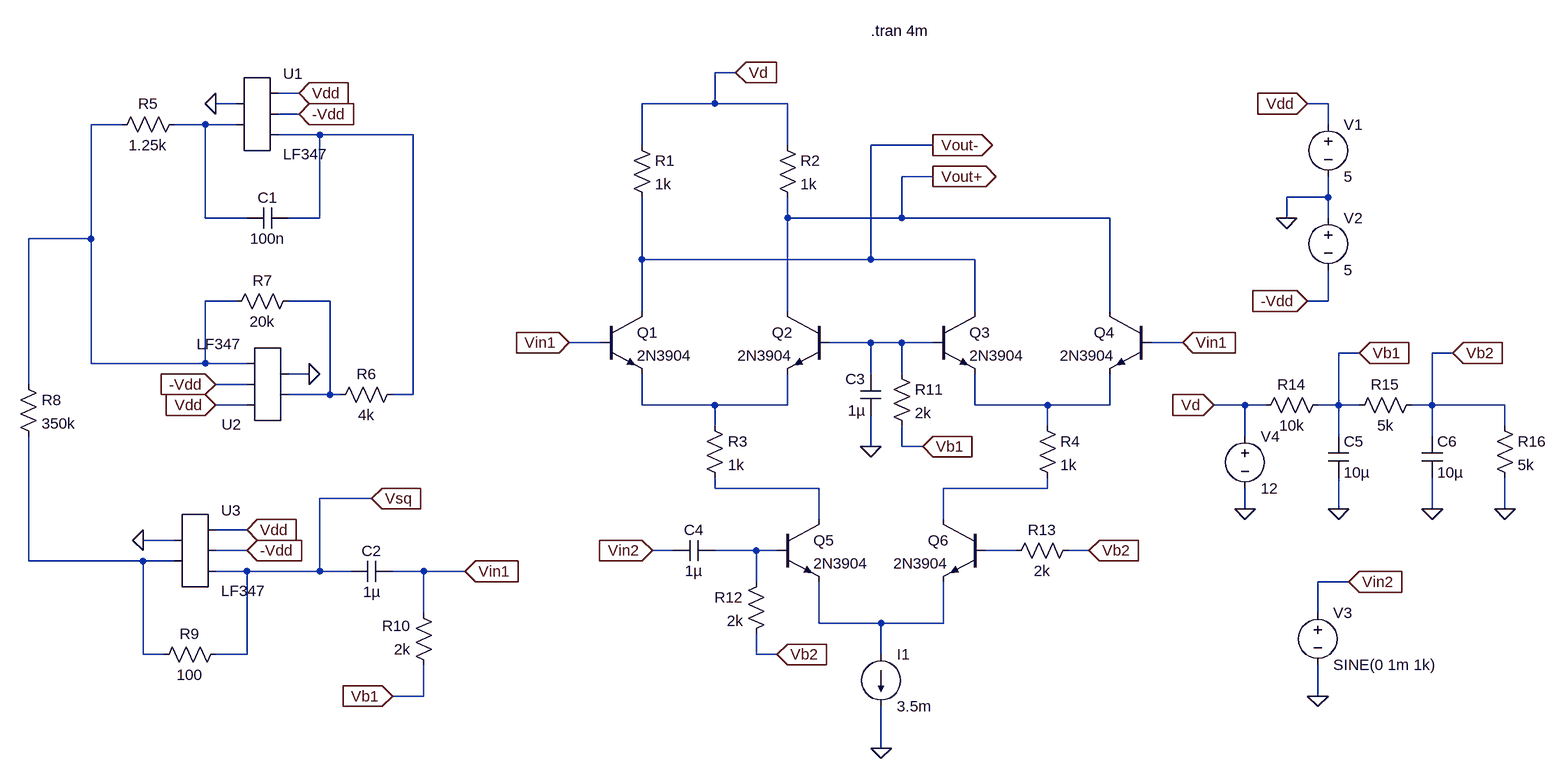
[diagram p0: schematic 3_Implementation.asc]
3_Implementation.asc, the LTspice schematic file:
Version 4
SHEET 1 1780 1148
WIRE 512 -48 480 -48
WIRE -160 -16 -192 -16
WIRE -256 0 -288 0
WIRE 480 0 480 -48
WIRE 480 0 368 0
WIRE 592 0 480 0
WIRE 1424 0 1392 0
WIRE -160 16 -192 16
WIRE -432 32 -480 32
WIRE -304 32 -352 32
WIRE -256 32 -304 32
WIRE 1424 32 1424 0
WIRE -128 48 -192 48
WIRE 16 48 -128 48
WIRE 368 64 368 0
WIRE 592 64 592 0
WIRE 816 64 720 64
WIRE 816 112 768 112
WIRE 1424 144 1424 112
WIRE 1424 144 1360 144
WIRE -304 176 -304 32
WIRE -240 176 -304 176
WIRE -128 176 -128 48
WIRE -128 176 -176 176
WIRE 592 176 592 144
WIRE 768 176 768 112
WIRE 768 176 592 176
WIRE 1088 176 768 176
WIRE 1360 176 1360 144
WIRE 1424 176 1424 144
WIRE -480 208 -480 32
WIRE -480 208 -576 208
WIRE 368 240 368 144
WIRE 720 240 720 64
WIRE 720 240 368 240
WIRE 880 240 720 240
WIRE -256 304 -304 304
WIRE -112 304 -176 304
WIRE 1424 304 1424 256
WIRE 1424 304 1392 304
WIRE 368 320 368 240
WIRE 592 320 592 176
WIRE 880 320 880 240
WIRE 1088 320 1088 176
WIRE 304 368 256 368
WIRE 720 368 656 368
WIRE 768 368 720 368
WIRE 816 368 768 368
WIRE 1200 368 1152 368
WIRE 1472 384 1440 384
WIRE 1616 384 1584 384
WIRE -480 400 -480 208
WIRE -304 400 -304 304
WIRE -304 400 -480 400
WIRE -240 400 -304 400
WIRE -144 416 -176 416
WIRE 720 416 720 368
WIRE 768 416 768 368
WIRE -576 432 -576 208
WIRE -240 432 -288 432
WIRE -112 448 -112 304
WIRE -112 448 -176 448
WIRE -96 448 -112 448
WIRE 16 448 16 48
WIRE 16 448 -16 448
WIRE -240 464 -288 464
WIRE 368 464 368 416
WIRE 480 464 368 464
WIRE 592 464 592 416
WIRE 592 464 480 464
WIRE 880 464 880 416
WIRE 992 464 880 464
WIRE 1088 464 1088 416
WIRE 1088 464 992 464
WIRE 1296 464 1248 464
WIRE 1328 464 1296 464
WIRE 1440 464 1440 384
WIRE 1440 464 1408 464
WIRE 1472 464 1440 464
WIRE 1584 464 1584 384
WIRE 1584 464 1552 464
WIRE 1696 464 1584 464
WIRE 480 496 480 464
WIRE 992 496 992 464
WIRE 1696 496 1696 464
WIRE 1296 512 1296 464
WIRE 1440 512 1440 464
WIRE 1584 512 1584 464
WIRE 720 528 720 480
WIRE 768 528 768 496
WIRE 800 528 768 528
WIRE 480 592 480 576
WIRE 640 592 480 592
WIRE 992 592 992 576
WIRE 992 592 832 592
WIRE -48 608 -128 608
WIRE 1296 624 1296 592
WIRE 1440 624 1440 576
WIRE 1584 624 1584 576
WIRE 1696 624 1696 576
WIRE 640 640 640 592
WIRE 832 640 832 592
WIRE -240 656 -288 656
WIRE -352 672 -400 672
WIRE -240 688 -288 688
WIRE 416 688 384 688
WIRE 544 688 480 688
WIRE 576 688 544 688
WIRE 944 688 896 688
WIRE 1056 688 1024 688
WIRE -576 704 -576 512
WIRE -400 704 -576 704
WIRE -352 704 -400 704
WIRE -240 720 -288 720
WIRE -128 720 -128 608
WIRE -128 720 -240 720
WIRE -80 720 -128 720
WIRE 32 720 -16 720
WIRE 96 720 32 720
WIRE 544 736 544 688
WIRE 1456 736 1408 736
WIRE 32 784 32 720
WIRE 1408 784 1408 736
WIRE 640 800 640 736
WIRE 736 800 640 800
WIRE 832 800 832 736
WIRE 832 800 736 800
WIRE -400 848 -400 704
WIRE -368 848 -400 848
WIRE -240 848 -240 720
WIRE -240 848 -288 848
WIRE 544 848 544 816
WIRE 576 848 544 848
WIRE 736 848 736 800
WIRE 32 912 32 864
WIRE 32 912 -16 912
WIRE 1408 912 1408 864
WIRE 736 992 736 928
FLAG 512 -48 Vd
IOPIN 512 -48 In
FLAG 736 992 0
FLAG 816 112 Vout+
IOPIN 816 112 Out
FLAG 816 64 Vout-
IOPIN 816 64 Out
FLAG 1392 304 -Vdd
IOPIN 1392 304 In
FLAG 1392 0 Vdd
IOPIN 1392 0 In
FLAG 1360 176 0
FLAG -160 -16 Vdd
IOPIN -160 -16 In
FLAG -160 16 -Vdd
IOPIN -160 16 In
FLAG -288 464 Vdd
IOPIN -288 464 In
FLAG -288 432 -Vdd
IOPIN -288 432 In
FLAG -288 0 0
FLAG -144 416 0
FLAG -400 672 0
FLAG -240 656 Vdd
IOPIN -240 656 In
FLAG -240 688 -Vdd
IOPIN -240 688 In
FLAG -16 912 Vb1
IOPIN -16 912 In
FLAG 96 720 Vin1
IOPIN 96 720 In
FLAG 256 368 Vin1
IOPIN 256 368 In
FLAG 1200 368 Vin1
IOPIN 1200 368 In
FLAG 720 528 0
FLAG 800 528 Vb1
IOPIN 800 528 In
FLAG 576 848 Vb2
IOPIN 576 848 In
FLAG 1056 688 Vb2
IOPIN 1056 688 In
FLAG 384 688 Vin2
IOPIN 384 688 In
FLAG 1408 912 0
FLAG 1456 736 Vin2
IOPIN 1456 736 In
FLAG 1296 624 0
FLAG 1696 624 0
FLAG 1584 624 0
FLAG 1440 624 0
FLAG 1472 384 Vb1
IOPIN 1472 384 In
FLAG 1616 384 Vb2
IOPIN 1616 384 In
FLAG 1248 464 Vd
IOPIN 1248 464 In
FLAG -48 608 Vsq
IOPIN -48 608 In
SYMBOL npn 304 320 R0
SYMATTR InstName Q1
SYMATTR Value 2N3904
SYMBOL npn 656 320 M0
SYMATTR InstName Q2
SYMATTR Value 2N3904
SYMBOL npn 816 320 R0
SYMATTR InstName Q3
SYMATTR Value 2N3904
SYMBOL npn 1152 320 M0
SYMATTR InstName Q4
SYMATTR Value 2N3904
SYMBOL res 352 48 R0
SYMATTR InstName R1
SYMATTR Value 1k
SYMBOL res 576 48 R0
SYMATTR InstName R2
SYMATTR Value 1k
SYMBOL npn 576 640 R0
SYMATTR InstName Q5
SYMATTR Value 2N3904
SYMBOL npn 896 640 M0
SYMATTR InstName Q6
SYMATTR Value 2N3904
SYMBOL current 736 848 R0
SYMATTR InstName I1
SYMATTR Value 3.5m
SYMBOL res 464 480 R0
SYMATTR InstName R3
SYMATTR Value 1k
SYMBOL res 976 480 R0
SYMATTR InstName R4
SYMATTR Value 1k
SYMBOL AutoGenerated/LF347 -224 16 R0
SYMATTR InstName U1
SYMBOL AutoGenerated/LF347 -208 432 R180
SYMATTR InstName U2
SYMBOL voltage 1424 16 R0
SYMATTR InstName V1
SYMATTR Value 5
SYMBOL voltage 1424 160 R0
SYMATTR InstName V2
SYMATTR Value 5
SYMBOL res -336 16 R90
WINDOW 0 0 56 VBottom 2
WINDOW 3 32 56 VTop 2
SYMATTR InstName R5
SYMATTR Value 1.25k
SYMBOL res 0 432 R90
WINDOW 0 0 56 VBottom 2
WINDOW 3 32 56 VTop 2
SYMATTR InstName R6
SYMATTR Value 4k
SYMBOL res -160 288 R90
WINDOW 0 0 56 VBottom 2
WINDOW 3 32 56 VTop 2
SYMATTR InstName R7
SYMATTR Value 20k
SYMBOL cap -176 160 R90
WINDOW 0 0 32 VBottom 2
WINDOW 3 32 32 VTop 2
SYMATTR InstName C1
SYMATTR Value 100n
SYMBOL AutoGenerated/LF347 -320 688 R0
SYMATTR InstName U3
SYMBOL res -592 416 R0
SYMATTR InstName R8
SYMATTR Value 350k
SYMBOL res -272 832 R90
WINDOW 0 0 56 VBottom 2
WINDOW 3 32 56 VTop 2
SYMATTR InstName R9
SYMATTR Value 100
SYMBOL cap -16 704 R90
WINDOW 0 0 32 VBottom 2
WINDOW 3 32 32 VTop 2
SYMATTR InstName C2
SYMATTR Value 1µ
SYMBOL res 48 880 R180
WINDOW 0 36 76 Left 2
WINDOW 3 36 40 Left 2
SYMATTR InstName R10
SYMATTR Value 2k
SYMBOL res 752 400 R0
SYMATTR InstName R11
SYMATTR Value 2k
SYMBOL cap 736 416 M0
SYMATTR InstName C3
SYMATTR Value 1µ
SYMBOL res 560 720 M0
SYMATTR InstName R12
SYMATTR Value 2k
SYMBOL res 928 704 R270
WINDOW 0 32 56 VTop 2
WINDOW 3 0 56 VBottom 2
SYMATTR InstName R13
SYMATTR Value 2k
SYMBOL cap 480 672 R90
WINDOW 0 0 32 VBottom 2
WINDOW 3 32 32 VTop 2
SYMATTR InstName C4
SYMATTR Value 1µ
SYMBOL voltage 1408 768 R0
SYMATTR InstName V3
SYMATTR Value SINE(0 1m 1k)
SYMBOL voltage 1296 496 R0
SYMATTR InstName V4
SYMATTR Value 12
SYMBOL res 1424 448 R90
WINDOW 0 0 56 VBottom 2
WINDOW 3 32 56 VTop 2
SYMATTR InstName R14
SYMATTR Value 10k
SYMBOL res 1568 448 R90
WINDOW 0 0 56 VBottom 2
WINDOW 3 32 56 VTop 2
SYMATTR InstName R15
SYMATTR Value 5k
SYMBOL res 1680 480 R0
SYMATTR InstName R16
SYMATTR Value 5k
SYMBOL cap 1424 512 R0
SYMATTR InstName C5
SYMATTR Value 10µ
SYMBOL cap 1568 512 R0
SYMATTR InstName C6
SYMATTR Value 10µ
TEXT 720 -112 Left 2 !.tran 4m

The netlist it stands for:
* 3_Implementation.asc
Q1 Vout- Vin1 N006 0 2N3904
Q2 Vout+ N005 N006 0 2N3904
Q3 Vout- N005 N007 0 2N3904
Q4 Vout+ Vin1 N007 0 2N3904
R1 Vd Vout- 1k
R2 Vd Vout+ 1k
Q5 N008 N010 N013 0 2N3904
Q6 N009 N011 N013 0 2N3904
I1 N013 0 3.5m
R3 N006 N008 1k
R4 N007 N009 1k
* U1: LF347 (symbol AutoGenerated/LF347 not available, pins judged from their places): pin1=0 pin2=N002 pin3=Vdd pin4=-Vdd pin5=N003
* U2: LF347 (symbol AutoGenerated/LF347 not available, pins judged from their places): pin1=N004 pin2=0 pin3=Vdd pin4=-Vdd pin5=N001
V1 Vdd 0 5
V2 0 -Vdd 5
R5 N002 N001 1.25k
R6 N003 N004 4k
R7 N004 N001 20k
C1 N003 N002 100n
* U3: LF347 (symbol AutoGenerated/LF347 not available, pins judged from their places): pin1=0 pin2=N012 pin3=Vdd pin4=-Vdd pin5=Vsq
R8 N001 N012 350k
R9 Vsq N012 100
C2 Vin1 Vsq 1µ
R10 Vb1 Vin1 2k
R11 N005 Vb1 2k
C3 N005 0 1µ
R12 N010 Vb2 2k
R13 N011 Vb2 2k
C4 N010 Vin2 1µ
V3 Vin2 0 SINE(0 1m 1k)
V4 Vd 0 12
R14 Vb1 Vd 10k
R15 Vb2 Vb1 5k
R16 Vb2 0 5k
C5 Vb1 0 10µ
C6 Vb2 0 10µ
.model NPN NPN
.model PNP PNP
.lib standard.bjt
.tran 4m
.backanno
.end